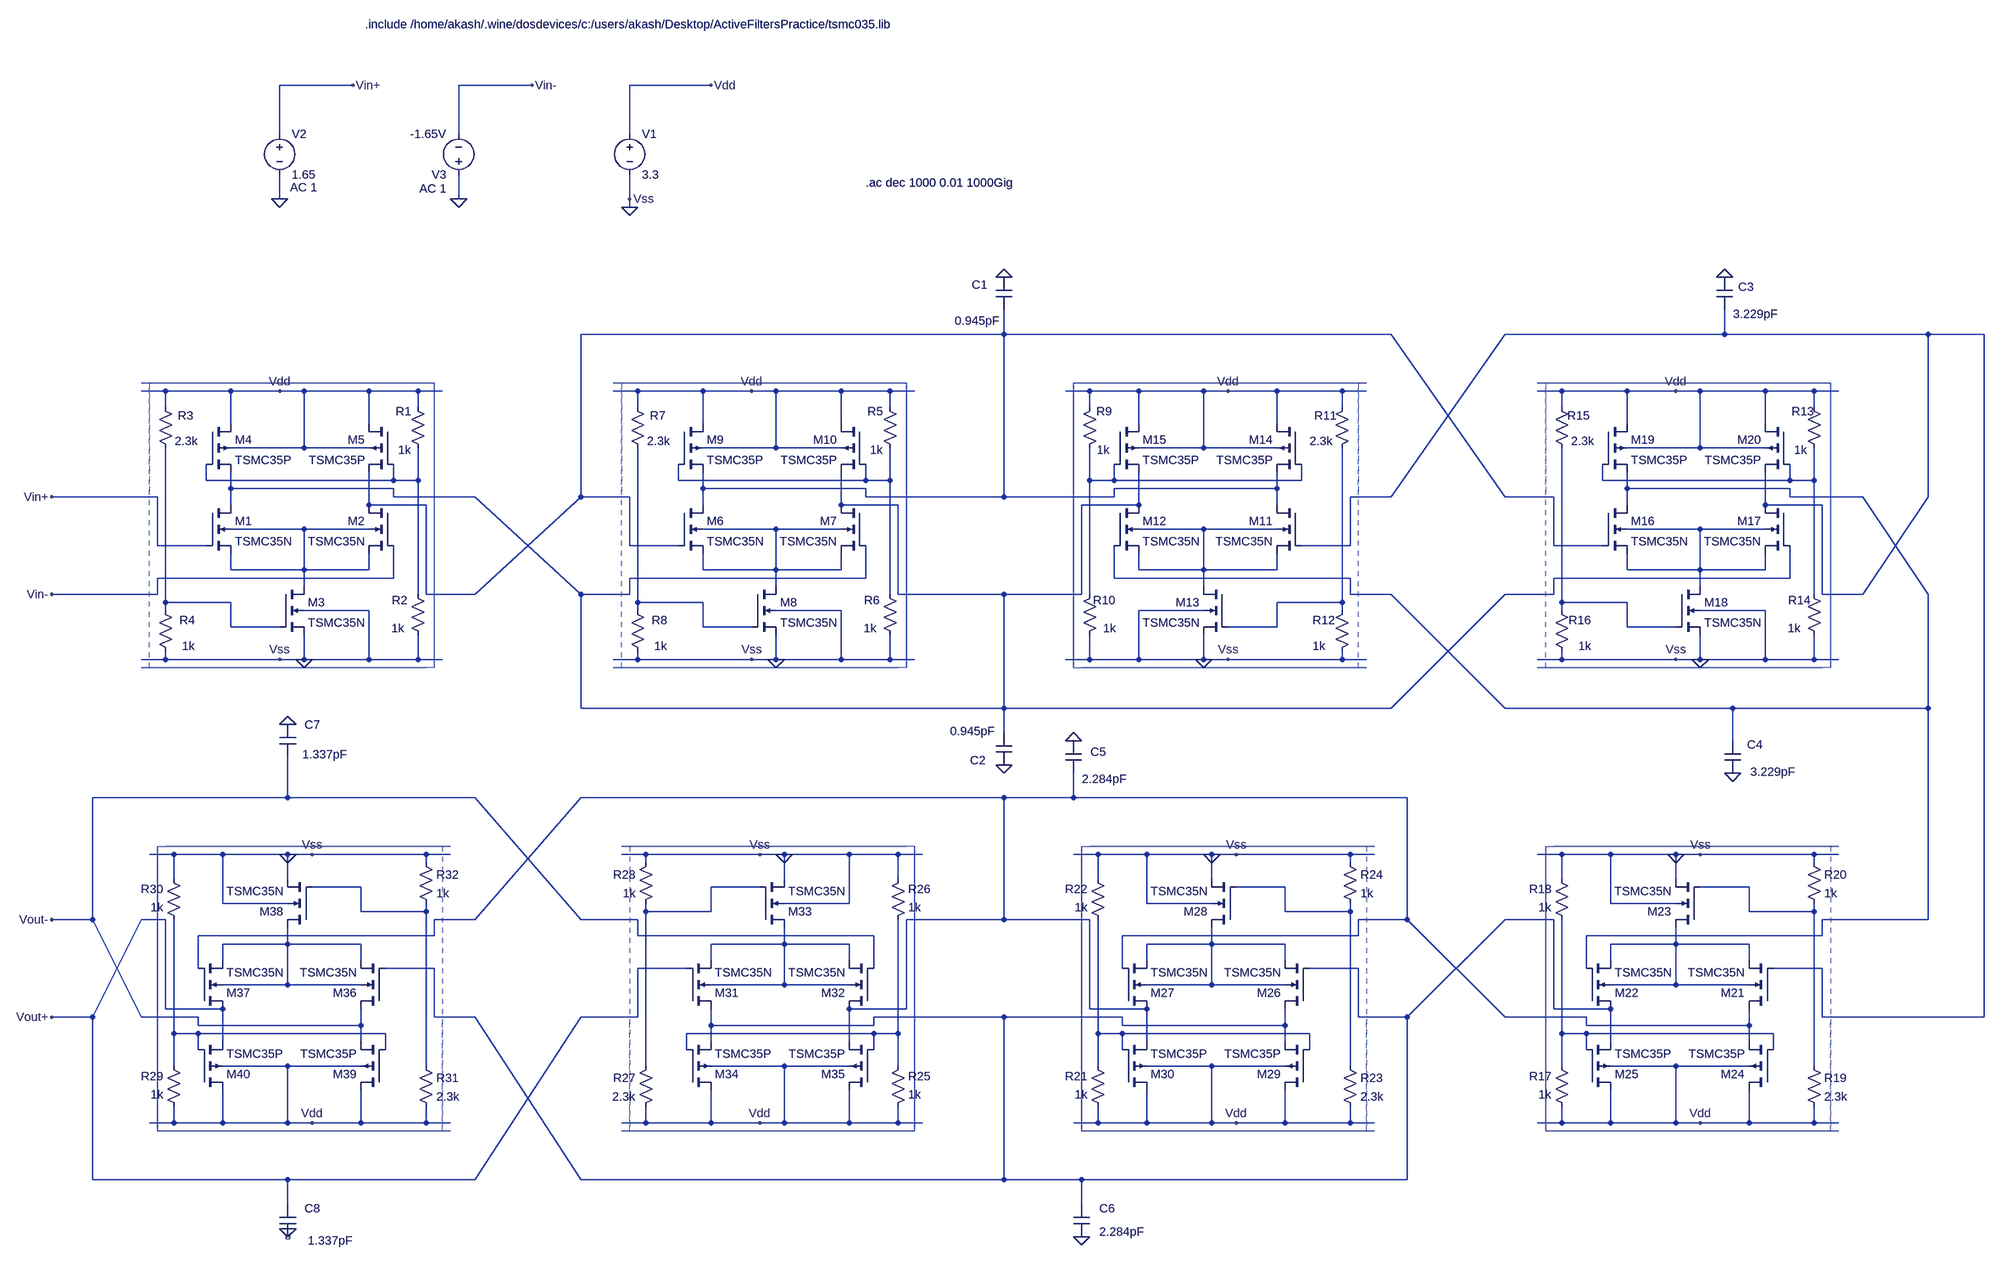
[diagram p0: schematic AF_Project_Transistor_Level_Realization.asc]
AF_Project_Transistor_Level_Realization.asc, the LTspice schematic file:
Version 4
SHEET 1 3188 1768
WIRE -144 -592 -288 -592
WIRE 208 -592 64 -592
WIRE 560 -592 400 -592
WIRE -288 -496 -288 -592
WIRE 64 -496 64 -592
WIRE 400 -496 400 -592
WIRE -288 -368 -288 -416
WIRE 64 -368 64 -416
WIRE 400 -368 400 -416
WIRE 400 -352 400 -368
WIRE 1136 -32 1136 -80
WIRE 1136 -32 304 -32
WIRE 2000 -32 1136 -32
WIRE 2656 -32 2656 -80
WIRE 2656 -32 2224 -32
WIRE 3056 -32 2656 -32
WIRE 3184 -32 3056 -32
WIRE -512 80 -560 80
WIRE -384 80 -512 80
WIRE -288 80 -384 80
WIRE -240 80 -288 80
WIRE -112 80 -240 80
WIRE -16 80 -112 80
WIRE 32 80 -16 80
WIRE 416 80 368 80
WIRE 544 80 416 80
WIRE 640 80 544 80
WIRE 688 80 640 80
WIRE 816 80 688 80
WIRE 912 80 816 80
WIRE 960 80 912 80
WIRE 1408 80 1360 80
WIRE 1504 80 1408 80
WIRE 1632 80 1504 80
WIRE 1680 80 1632 80
WIRE 1776 80 1680 80
WIRE 1904 80 1776 80
WIRE 1952 80 1904 80
WIRE 2336 80 2288 80
WIRE 2464 80 2336 80
WIRE 2560 80 2464 80
WIRE 2608 80 2560 80
WIRE 2736 80 2608 80
WIRE 2832 80 2736 80
WIRE 2880 80 2832 80
WIRE -512 112 -512 80
WIRE -16 112 -16 80
WIRE 416 112 416 80
WIRE 912 112 912 80
WIRE 1408 112 1408 80
WIRE 1904 112 1904 80
WIRE 2336 112 2336 80
WIRE 2832 112 2832 80
WIRE -384 144 -384 80
WIRE -112 144 -112 80
WIRE 544 144 544 80
WIRE 816 144 816 80
WIRE 1504 144 1504 80
WIRE 1776 144 1776 80
WIRE 2464 144 2464 80
WIRE 2736 144 2736 80
WIRE -240 192 -240 80
WIRE -240 192 -384 192
WIRE -112 192 -240 192
WIRE 688 192 688 80
WIRE 688 192 544 192
WIRE 816 192 688 192
WIRE 1632 192 1632 80
WIRE 1632 192 1504 192
WIRE 1776 192 1632 192
WIRE 2608 192 2608 80
WIRE 2608 192 2464 192
WIRE 2736 192 2608 192
WIRE -432 256 -432 224
WIRE -64 256 -64 224
WIRE -64 256 -432 256
WIRE -16 256 -16 192
WIRE -16 256 -64 256
WIRE 496 256 496 224
WIRE 864 256 864 224
WIRE 864 256 496 256
WIRE 912 256 912 192
WIRE 912 256 864 256
WIRE 1408 256 1408 192
WIRE 1456 256 1456 224
WIRE 1456 256 1408 256
WIRE 1824 256 1824 224
WIRE 1824 256 1456 256
WIRE 2416 256 2416 224
WIRE 2784 256 2784 224
WIRE 2784 256 2416 256
WIRE 2832 256 2832 192
WIRE 2832 256 2784 256
WIRE -384 272 -384 240
WIRE -64 272 -384 272
WIRE 544 272 544 240
WIRE 864 272 544 272
WIRE 1776 272 1776 240
WIRE 1776 272 1456 272
WIRE 2464 272 2464 240
WIRE 2784 272 2464 272
WIRE -528 288 -736 288
WIRE -64 288 -64 272
WIRE 96 288 -64 288
WIRE 304 288 304 -32
WIRE 400 288 304 288
WIRE 864 288 864 272
WIRE 1136 288 1136 -32
WIRE 1136 288 864 288
WIRE 1456 288 1456 272
WIRE 1456 288 1136 288
WIRE 2000 288 2224 -32
WIRE 2000 288 1920 288
WIRE 2224 288 2000 -32
WIRE 2320 288 2224 288
WIRE 2784 288 2784 272
WIRE 2928 288 2784 288
WIRE 3056 288 3056 -32
WIRE -384 304 -384 272
WIRE -112 304 -112 240
WIRE 0 304 -112 304
WIRE 544 304 544 272
WIRE 816 304 816 240
WIRE 928 304 816 304
WIRE 1504 304 1504 240
WIRE 1504 304 1392 304
WIRE 1776 304 1776 272
WIRE 2464 304 2464 272
WIRE 2736 304 2736 240
WIRE 2848 304 2736 304
WIRE -240 352 -384 352
WIRE -112 352 -240 352
WIRE 688 352 544 352
WIRE 816 352 688 352
WIRE 1632 352 1504 352
WIRE 1776 352 1632 352
WIRE 2608 352 2464 352
WIRE 2736 352 2608 352
WIRE -528 384 -528 288
WIRE -432 384 -528 384
WIRE 400 384 400 288
WIRE 496 384 400 384
WIRE 1920 384 1920 288
WIRE 1920 384 1824 384
WIRE 2320 384 2320 288
WIRE 2416 384 2320 384
WIRE -384 432 -384 400
WIRE -240 432 -240 352
WIRE -240 432 -384 432
WIRE -112 432 -112 400
WIRE -112 432 -240 432
WIRE 544 432 544 400
WIRE 688 432 688 352
WIRE 688 432 544 432
WIRE 816 432 816 400
WIRE 816 432 688 432
WIRE 1504 432 1504 400
WIRE 1632 432 1632 352
WIRE 1632 432 1504 432
WIRE 1776 432 1776 400
WIRE 1776 432 1632 432
WIRE 2464 432 2464 400
WIRE 2608 432 2608 352
WIRE 2608 432 2464 432
WIRE 2736 432 2736 400
WIRE 2736 432 2608 432
WIRE -64 448 -64 384
WIRE -64 448 -528 448
WIRE 864 448 864 384
WIRE 864 448 400 448
WIRE 1456 448 1456 384
WIRE 1920 448 1456 448
WIRE 2784 448 2784 384
WIRE 2784 448 2320 448
WIRE -240 464 -240 432
WIRE 688 464 688 432
WIRE 1632 464 1632 432
WIRE 2608 464 2608 432
WIRE -528 480 -528 448
WIRE -528 480 -736 480
WIRE -16 480 -16 256
WIRE 0 480 0 304
WIRE 96 480 304 288
WIRE 96 480 0 480
WIRE 304 480 96 288
WIRE 400 480 400 448
WIRE 400 480 304 480
WIRE 912 480 912 256
WIRE 928 480 928 304
WIRE 1136 480 928 480
WIRE 1392 480 1392 304
WIRE 1392 480 1136 480
WIRE 1408 480 1408 256
WIRE 1920 480 1920 448
WIRE 2000 480 1920 480
WIRE 2320 480 2320 448
WIRE 2320 480 2224 480
WIRE 2832 480 2832 256
WIRE 2848 480 2848 304
WIRE 2928 480 3056 288
WIRE 2928 480 2848 480
WIRE 3056 480 2928 288
WIRE -512 496 -512 192
WIRE -384 496 -512 496
WIRE 416 496 416 192
WIRE 544 496 416 496
WIRE 1904 496 1904 192
WIRE 1904 496 1776 496
WIRE 2336 496 2336 192
WIRE 2464 496 2336 496
WIRE -512 512 -512 496
WIRE -112 512 -240 512
WIRE 416 512 416 496
WIRE 816 512 688 512
WIRE 1632 512 1504 512
WIRE 1904 512 1904 496
WIRE 2336 512 2336 496
WIRE 2736 512 2608 512
WIRE -384 544 -384 496
WIRE -288 544 -384 544
WIRE 544 544 544 496
WIRE 640 544 544 544
WIRE 1776 544 1776 496
WIRE 1776 544 1680 544
WIRE 2464 544 2464 496
WIRE 2560 544 2464 544
WIRE -512 608 -512 592
WIRE -512 608 -560 608
WIRE -288 608 -512 608
WIRE -240 608 -240 560
WIRE -240 608 -288 608
WIRE -112 608 -112 512
WIRE -112 608 -240 608
WIRE -16 608 -16 560
WIRE -16 608 -112 608
WIRE 32 608 -16 608
WIRE 416 608 416 592
WIRE 416 608 368 608
WIRE 640 608 416 608
WIRE 688 608 688 560
WIRE 688 608 640 608
WIRE 816 608 816 512
WIRE 816 608 688 608
WIRE 912 608 912 560
WIRE 912 608 816 608
WIRE 960 608 912 608
WIRE 1408 608 1408 560
WIRE 1408 608 1360 608
WIRE 1504 608 1504 512
WIRE 1504 608 1408 608
WIRE 1632 608 1632 560
WIRE 1632 608 1504 608
WIRE 1680 608 1632 608
WIRE 1904 608 1904 592
WIRE 1904 608 1680 608
WIRE 1952 608 1904 608
WIRE 2336 608 2336 592
WIRE 2336 608 2288 608
WIRE 2560 608 2336 608
WIRE 2608 608 2608 560
WIRE 2608 608 2560 608
WIRE 2736 608 2736 512
WIRE 2736 608 2608 608
WIRE 2832 608 2832 560
WIRE 2832 608 2736 608
WIRE 2880 608 2832 608
WIRE 304 704 304 480
WIRE 1136 704 1136 480
WIRE 1136 704 304 704
WIRE 2000 704 2224 480
WIRE 2000 704 1136 704
WIRE 2224 704 2000 480
WIRE 2672 704 2224 704
WIRE 3056 704 3056 480
WIRE 3056 704 2672 704
WIRE 1136 752 1136 704
WIRE 2672 768 2672 704
WIRE -272 880 -272 800
WIRE -272 880 -656 880
WIRE 96 880 -272 880
WIRE 1136 880 304 880
WIRE 1376 880 1376 832
WIRE 1376 880 1136 880
WIRE 2032 880 1376 880
WIRE -496 992 -544 992
WIRE -400 992 -496 992
WIRE -272 992 -400 992
WIRE -224 992 -272 992
WIRE 0 992 -224 992
WIRE 48 992 0 992
WIRE 432 992 384 992
WIRE 656 992 432 992
WIRE 704 992 656 992
WIRE 832 992 704 992
WIRE 928 992 832 992
WIRE 976 992 928 992
WIRE 1424 992 1376 992
WIRE 1520 992 1424 992
WIRE 1648 992 1520 992
WIRE 1696 992 1648 992
WIRE 1920 992 1696 992
WIRE 1968 992 1920 992
WIRE 2336 992 2288 992
WIRE 2432 992 2336 992
WIRE 2560 992 2432 992
WIRE 2608 992 2560 992
WIRE 2832 992 2608 992
WIRE 2880 992 2832 992
WIRE 0 1008 0 992
WIRE 432 1008 432 992
WIRE 1920 1008 1920 992
WIRE 2832 1008 2832 992
WIRE -496 1040 -496 992
WIRE -272 1040 -272 992
WIRE 704 1040 704 992
WIRE 928 1040 928 992
WIRE 1424 1040 1424 992
WIRE 1648 1040 1648 992
WIRE 2336 1040 2336 992
WIRE 2560 1040 2560 992
WIRE -128 1056 -224 1056
WIRE 656 1056 560 1056
WIRE 1792 1056 1696 1056
WIRE 2704 1056 2608 1056
WIRE -400 1088 -400 992
WIRE -272 1088 -400 1088
WIRE 832 1088 832 992
WIRE 832 1088 704 1088
WIRE 1520 1088 1520 992
WIRE 1648 1088 1520 1088
WIRE 2432 1088 2432 992
WIRE 2560 1088 2432 1088
WIRE -128 1104 -128 1056
WIRE 0 1104 0 1088
WIRE 0 1104 -128 1104
WIRE 432 1104 432 1088
WIRE 560 1104 560 1056
WIRE 560 1104 432 1104
WIRE 1792 1104 1792 1056
WIRE 1920 1104 1920 1088
WIRE 1920 1104 1792 1104
WIRE 2704 1104 2704 1056
WIRE 2832 1104 2832 1088
WIRE 2832 1104 2704 1104
WIRE -656 1120 -656 880
WIRE -656 1120 -736 1120
WIRE -512 1120 -560 1120
WIRE 96 1120 304 880
WIRE 96 1120 16 1120
WIRE 304 1120 96 880
WIRE 416 1120 304 1120
WIRE 1136 1120 1136 880
WIRE 1136 1120 944 1120
WIRE 1408 1120 1136 1120
WIRE 2032 1120 2032 880
WIRE 2032 1120 1936 1120
WIRE 2320 1120 2224 1120
WIRE 3056 1120 3056 704
WIRE 3056 1120 2848 1120
WIRE 16 1152 16 1120
WIRE 16 1152 -448 1152
WIRE 416 1152 416 1120
WIRE 880 1152 416 1152
WIRE 1936 1152 1936 1120
WIRE 1936 1152 1472 1152
WIRE 2848 1152 2848 1120
WIRE 2848 1152 2384 1152
WIRE -272 1168 -272 1136
WIRE -272 1168 -400 1168
WIRE -128 1168 -272 1168
WIRE 704 1168 704 1136
WIRE 704 1168 560 1168
WIRE 832 1168 704 1168
WIRE 1648 1168 1648 1136
WIRE 1648 1168 1520 1168
WIRE 1792 1168 1648 1168
WIRE 2560 1168 2560 1136
WIRE 2560 1168 2432 1168
WIRE 2704 1168 2560 1168
WIRE -400 1200 -400 1168
WIRE -128 1200 -128 1168
WIRE 560 1200 560 1168
WIRE 832 1200 832 1168
WIRE 1520 1200 1520 1168
WIRE 1792 1200 1792 1168
WIRE 2432 1200 2432 1168
WIRE 2704 1200 2704 1168
WIRE -448 1216 -448 1152
WIRE 16 1216 -80 1216
WIRE 512 1216 416 1216
WIRE 880 1216 880 1152
WIRE 1472 1216 1472 1152
WIRE 1936 1216 1840 1216
WIRE 2384 1216 2384 1152
WIRE 2848 1216 2752 1216
WIRE -272 1248 -272 1168
WIRE -272 1248 -400 1248
WIRE -128 1248 -272 1248
WIRE 704 1248 704 1168
WIRE 704 1248 560 1248
WIRE 832 1248 704 1248
WIRE 1648 1248 1648 1168
WIRE 1648 1248 1520 1248
WIRE 1792 1248 1648 1248
WIRE 2560 1248 2560 1168
WIRE 2560 1248 2432 1248
WIRE 2704 1248 2560 1248
WIRE -512 1296 -512 1120
WIRE -400 1296 -512 1296
WIRE 944 1296 944 1120
WIRE 944 1296 832 1296
WIRE 1408 1296 1408 1120
WIRE 1520 1296 1408 1296
WIRE 2320 1296 2320 1120
WIRE 2432 1296 2320 1296
WIRE -656 1312 -560 1120
WIRE -656 1312 -736 1312
WIRE -560 1312 -656 1120
WIRE -448 1312 -560 1312
WIRE 16 1312 16 1216
WIRE 96 1312 16 1312
WIRE 416 1312 416 1216
WIRE 416 1312 304 1312
WIRE 1136 1312 880 1312
WIRE 1472 1312 1136 1312
WIRE 1936 1312 1936 1216
WIRE 2032 1312 2224 1120
WIRE 2032 1312 1936 1312
WIRE 2224 1312 2032 1120
WIRE 2384 1312 2224 1312
WIRE 2848 1312 2848 1216
WIRE 3184 1312 3184 -32
WIRE 3184 1312 2848 1312
WIRE -448 1328 -448 1312
WIRE -128 1328 -128 1296
WIRE -128 1328 -448 1328
WIRE 560 1328 560 1296
WIRE 880 1328 880 1312
WIRE 880 1328 560 1328
WIRE 1472 1328 1472 1312
WIRE 1792 1328 1792 1296
WIRE 1792 1328 1472 1328
WIRE 2384 1328 2384 1312
WIRE 2704 1328 2704 1296
WIRE 2704 1328 2384 1328
WIRE -496 1344 -496 1120
WIRE -448 1344 -496 1344
WIRE -80 1344 -448 1344
WIRE 880 1344 512 1344
WIRE 928 1344 928 1120
WIRE 928 1344 880 1344
WIRE 1424 1344 1424 1120
WIRE 1472 1344 1424 1344
WIRE 1840 1344 1472 1344
WIRE 2336 1344 2336 1120
WIRE 2384 1344 2336 1344
WIRE 2752 1344 2384 1344
WIRE -400 1360 -400 1296
WIRE -128 1360 -128 1328
WIRE 560 1360 560 1328
WIRE 832 1360 832 1296
WIRE 1520 1360 1520 1296
WIRE 1792 1360 1792 1328
WIRE 2432 1360 2432 1296
WIRE 2704 1360 2704 1328
WIRE -448 1376 -448 1344
WIRE -80 1376 -80 1344
WIRE 512 1376 512 1344
WIRE 880 1376 880 1344
WIRE 1472 1376 1472 1344
WIRE 1840 1376 1840 1344
WIRE 2384 1376 2384 1344
WIRE 2752 1376 2752 1344
WIRE -496 1408 -496 1344
WIRE -272 1408 -400 1408
WIRE -128 1408 -272 1408
WIRE 0 1408 0 1104
WIRE 432 1408 432 1104
WIRE 704 1408 560 1408
WIRE 832 1408 704 1408
WIRE 928 1408 928 1344
WIRE 1424 1408 1424 1344
WIRE 1648 1408 1520 1408
WIRE 1792 1408 1648 1408
WIRE 1920 1408 1920 1104
WIRE 2336 1408 2336 1344
WIRE 2560 1408 2432 1408
WIRE 2704 1408 2560 1408
WIRE 2832 1408 2832 1104
WIRE -496 1520 -496 1488
WIRE -496 1520 -544 1520
WIRE -400 1520 -400 1456
WIRE -400 1520 -496 1520
WIRE -272 1520 -272 1408
WIRE -272 1520 -400 1520
WIRE -224 1520 -272 1520
WIRE -128 1520 -128 1456
WIRE -128 1520 -224 1520
WIRE 0 1520 0 1488
WIRE 0 1520 -128 1520
WIRE 48 1520 0 1520
WIRE 432 1520 432 1488
WIRE 432 1520 384 1520
WIRE 560 1520 560 1456
WIRE 560 1520 432 1520
WIRE 656 1520 560 1520
WIRE 704 1520 704 1408
WIRE 704 1520 656 1520
WIRE 832 1520 832 1456
WIRE 832 1520 704 1520
WIRE 928 1520 928 1488
WIRE 928 1520 832 1520
WIRE 976 1520 928 1520
WIRE 1424 1520 1424 1488
WIRE 1424 1520 1376 1520
WIRE 1520 1520 1520 1456
WIRE 1520 1520 1424 1520
WIRE 1648 1520 1648 1408
WIRE 1648 1520 1520 1520
WIRE 1696 1520 1648 1520
WIRE 1792 1520 1792 1456
WIRE 1792 1520 1696 1520
WIRE 1920 1520 1920 1488
WIRE 1920 1520 1792 1520
WIRE 1968 1520 1920 1520
WIRE 2336 1520 2336 1488
WIRE 2336 1520 2288 1520
WIRE 2432 1520 2432 1456
WIRE 2432 1520 2336 1520
WIRE 2560 1520 2560 1408
WIRE 2560 1520 2432 1520
WIRE 2608 1520 2560 1520
WIRE 2704 1520 2704 1456
WIRE 2704 1520 2608 1520
WIRE 2832 1520 2832 1488
WIRE 2832 1520 2704 1520
WIRE 2880 1520 2832 1520
WIRE -656 1632 -656 1312
WIRE -272 1632 -656 1632
WIRE 96 1632 304 1312
WIRE 96 1632 -272 1632
WIRE 304 1632 96 1312
WIRE 1136 1632 1136 1312
WIRE 1136 1632 304 1632
WIRE 1392 1632 1136 1632
WIRE 2032 1632 2032 1312
WIRE 2032 1632 1392 1632
WIRE -272 1680 -272 1632
WIRE 1392 1680 1392 1632
FLAG 400 -352 0
FLAG 400 -368 Vss
FLAG 560 -592 Vdd
FLAG -288 80 Vdd
FLAG -288 608 Vss
FLAG -240 608 0
FLAG -288 -368 0
FLAG -144 -592 Vin+
FLAG 64 -368 0
FLAG 208 -592 Vin-
FLAG 640 80 Vdd
FLAG 640 608 Vss
FLAG 688 608 0
FLAG 1680 80 Vdd
FLAG 1680 608 Vss
FLAG 1632 608 0
FLAG 2560 80 Vdd
FLAG 2560 608 Vss
FLAG 2608 608 0
FLAG 2608 1520 Vdd
FLAG 2608 992 Vss
FLAG 2560 992 0
FLAG 1696 1520 Vdd
FLAG 1696 992 Vss
FLAG 1648 992 0
FLAG 656 1520 Vdd
FLAG 656 992 Vss
FLAG 704 992 0
FLAG -224 1520 Vdd
FLAG -224 992 Vss
FLAG -272 992 0
FLAG -736 288 Vin+
FLAG -736 480 Vin-
FLAG 1136 -144 0
FLAG 1136 816 0
FLAG 2672 832 0
FLAG 2656 -144 0
FLAG 1376 768 0
FLAG 1392 1744 0
FLAG -272 736 0
FLAG -272 1728 0
FLAG -736 1312 Vout+
FLAG -736 1120 Vout-
SYMBOL nmos4 -432 304 R0
SYMATTR InstName M1
SYMATTR Value TSMC35N
SYMATTR Value2 l=0.5u w=55u m=2
SYMBOL nmos4 -64 304 M0
SYMATTR InstName M2
SYMATTR Value TSMC35N
SYMATTR Value2 l=0.5u w=55u m=2
SYMBOL nmos4 -288 464 R0
SYMATTR InstName M3
SYMATTR Value TSMC35N
SYMATTR Value2 l=0.5u w=12.2093u m=2
SYMBOL pmos4 -432 144 R0
SYMATTR InstName M4
SYMATTR Value TSMC35P
SYMATTR Value2 l=0.5u w=2u m=2
SYMBOL pmos4 -64 144 M0
SYMATTR InstName M5
SYMATTR Value TSMC35P
SYMATTR Value2 l=0.5u w=2u m=2
SYMBOL res -32 96 R0
WINDOW 0 -28 24 Left 2
WINDOW 3 -23 100 Left 2
SYMATTR InstName R1
SYMATTR Value 1k
SYMBOL res -32 464 R0
WINDOW 0 -35 28 Left 2
WINDOW 3 -36 83 Left 2
SYMATTR InstName R2
SYMATTR Value 1k
SYMBOL res -496 208 R180
WINDOW 0 -39 80 Left 2
WINDOW 3 -48 30 Left 2
SYMATTR InstName R3
SYMATTR Value 2.3k
SYMBOL res -496 608 R180
WINDOW 0 -42 77 Left 2
WINDOW 3 -42 26 Left 2
SYMATTR InstName R4
SYMATTR Value 1k
SYMBOL voltage 400 -512 R0
WINDOW 123 0 0 Left 0
WINDOW 39 0 0 Left 0
SYMATTR InstName V1
SYMATTR Value 3.3
SYMBOL voltage -288 -512 R0
WINDOW 123 21 121 Left 2
WINDOW 39 0 0 Left 0
SYMATTR InstName V2
SYMATTR Value 1.65
SYMATTR Value2 AC 1
SYMBOL voltage 64 -400 R180
WINDOW 123 24 -12 Left 2
WINDOW 39 0 0 Left 0
SYMATTR InstName V3
SYMATTR Value -1.65V
SYMATTR Value2 AC 1
SYMBOL nmos4 496 304 R0
SYMATTR InstName M6
SYMATTR Value TSMC35N
SYMATTR Value2 l=0.5u w=55u m=2
SYMBOL nmos4 864 304 M0
SYMATTR InstName M7
SYMATTR Value TSMC35N
SYMATTR Value2 l=0.5u w=55u m=2
SYMBOL nmos4 640 464 R0
SYMATTR InstName M8
SYMATTR Value TSMC35N
SYMATTR Value2 l=0.5u w=12.2093u m=2
SYMBOL pmos4 496 144 R0
SYMATTR InstName M9
SYMATTR Value TSMC35P
SYMATTR Value2 l=0.5u w=2u m=2
SYMBOL pmos4 864 144 M0
SYMATTR InstName M10
SYMATTR Value TSMC35P
SYMATTR Value2 l=0.5u w=2u m=2
SYMBOL res 896 96 R0
WINDOW 0 -28 24 Left 2
WINDOW 3 -23 100 Left 2
SYMATTR InstName R5
SYMATTR Value 1k
SYMBOL res 896 464 R0
WINDOW 0 -35 28 Left 2
WINDOW 3 -36 83 Left 2
SYMATTR InstName R6
SYMATTR Value 1k
SYMBOL res 432 208 R180
WINDOW 0 -39 80 Left 2
WINDOW 3 -48 30 Left 2
SYMATTR InstName R7
SYMATTR Value 2.3k
SYMBOL res 432 608 R180
WINDOW 0 -42 77 Left 2
WINDOW 3 -42 26 Left 2
SYMATTR InstName R8
SYMATTR Value 1k
SYMBOL nmos4 1824 304 M0
SYMATTR InstName M11
SYMATTR Value TSMC35N
SYMATTR Value2 l=0.5u w=55u m=2
SYMBOL nmos4 1456 304 R0
SYMATTR InstName M12
SYMATTR Value TSMC35N
SYMATTR Value2 l=0.5u w=55u m=2
SYMBOL nmos4 1680 464 M0
SYMATTR InstName M13
SYMATTR Value TSMC35N
SYMATTR Value2 l=0.5u w=12.2093u m=2
SYMBOL pmos4 1824 144 M0
SYMATTR InstName M14
SYMATTR Value TSMC35P
SYMATTR Value2 l=0.5u w=2u m=2
SYMBOL pmos4 1456 144 R0
SYMATTR InstName M15
SYMATTR Value TSMC35P
SYMATTR Value2 l=0.5u w=2u m=2
SYMBOL res 1424 96 M0
WINDOW 0 -28 24 Left 2
WINDOW 3 -23 100 Left 2
SYMATTR InstName R9
SYMATTR Value 1k
SYMBOL res 1424 464 M0
WINDOW 0 -35 28 Left 2
WINDOW 3 -36 83 Left 2
SYMATTR InstName R10
SYMATTR Value 1k
SYMBOL res 1888 208 M180
WINDOW 0 -39 80 Left 2
WINDOW 3 -48 30 Left 2
SYMATTR InstName R11
SYMATTR Value 2.3k
SYMBOL res 1888 608 M180
WINDOW 0 -42 77 Left 2
WINDOW 3 -42 26 Left 2
SYMATTR InstName R12
SYMATTR Value 1k
SYMBOL nmos4 2416 304 R0
SYMATTR InstName M16
SYMATTR Value TSMC35N
SYMATTR Value2 l=0.5u w=55u m=2
SYMBOL nmos4 2784 304 M0
SYMATTR InstName M17
SYMATTR Value TSMC35N
SYMATTR Value2 l=0.5u w=55u m=2
SYMBOL nmos4 2560 464 R0
SYMATTR InstName M18
SYMATTR Value TSMC35N
SYMATTR Value2 l=0.5u w=12.2093u m=2
SYMBOL pmos4 2416 144 R0
SYMATTR InstName M19
SYMATTR Value TSMC35P
SYMATTR Value2 l=0.5u w=2u m=2
SYMBOL pmos4 2784 144 M0
SYMATTR InstName M20
SYMATTR Value TSMC35P
SYMATTR Value2 l=0.5u w=2u m=2
SYMBOL res 2816 96 R0
WINDOW 0 -28 24 Left 2
WINDOW 3 -23 100 Left 2
SYMATTR InstName R13
SYMATTR Value 1k
SYMBOL res 2816 464 R0
WINDOW 0 -35 28 Left 2
WINDOW 3 -36 83 Left 2
SYMATTR InstName R14
SYMATTR Value 1k
SYMBOL res 2352 208 R180
WINDOW 0 -39 80 Left 2
WINDOW 3 -48 30 Left 2
SYMATTR InstName R15
SYMATTR Value 2.3k
SYMBOL res 2352 608 R180
WINDOW 0 -42 77 Left 2
WINDOW 3 -42 26 Left 2
SYMATTR InstName R16
SYMATTR Value 1k
SYMBOL nmos4 2752 1296 R180
SYMATTR InstName M21
SYMATTR Value TSMC35N
SYMATTR Value2 l=0.5u w=55u m=2
SYMBOL nmos4 2384 1296 M180
SYMATTR InstName M22
SYMATTR Value TSMC35N
SYMATTR Value2 l=0.5u w=55u m=2
SYMBOL nmos4 2608 1136 R180
SYMATTR InstName M23
SYMATTR Value TSMC35N
SYMATTR Value2 l=0.5u w=12.2093u m=2
SYMBOL pmos4 2752 1456 R180
SYMATTR InstName M24
SYMATTR Value TSMC35P
SYMATTR Value2 l=0.5u w=2u m=2
SYMBOL pmos4 2384 1456 M180
SYMATTR InstName M25
SYMATTR Value TSMC35P
SYMATTR Value2 l=0.5u w=2u m=2
SYMBOL res 2352 1504 R180
WINDOW 0 36 76 Left 2
WINDOW 3 36 40 Left 2
SYMATTR InstName R17
SYMATTR Value 1k
SYMBOL res 2352 1136 R180
WINDOW 0 36 76 Left 2
WINDOW 3 36 40 Left 2
SYMATTR InstName R18
SYMATTR Value 1k
SYMBOL res 2816 1392 R0
SYMATTR InstName R19
SYMATTR Value 2.3k
SYMBOL res 2816 992 R0
SYMATTR InstName R20
SYMATTR Value 1k
SYMBOL nmos4 1840 1296 R180
SYMATTR InstName M26
SYMATTR Value TSMC35N
SYMATTR Value2 l=0.5u w=55u m=2
SYMBOL nmos4 1472 1296 M180
SYMATTR InstName M27
SYMATTR Value TSMC35N
SYMATTR Value2 l=0.5u w=55u m=2
SYMBOL nmos4 1696 1136 R180
SYMATTR InstName M28
SYMATTR Value TSMC35N
SYMATTR Value2 l=0.5u w=12.2093u m=2
SYMBOL pmos4 1840 1456 R180
SYMATTR InstName M29
SYMATTR Value TSMC35P
SYMATTR Value2 l=0.5u w=2u m=2
SYMBOL pmos4 1472 1456 M180
SYMATTR InstName M30
SYMATTR Value TSMC35P
SYMATTR Value2 l=0.5u w=2u m=2
SYMBOL res 1440 1504 R180
WINDOW 0 36 76 Left 2
WINDOW 3 36 40 Left 2
SYMATTR InstName R21
SYMATTR Value 1k
SYMBOL res 1440 1136 R180
WINDOW 0 36 76 Left 2
WINDOW 3 36 40 Left 2
SYMATTR InstName R22
SYMATTR Value 1k
SYMBOL res 1904 1392 R0
SYMATTR InstName R23
SYMATTR Value 2.3k
SYMBOL res 1904 992 R0
SYMATTR InstName R24
SYMATTR Value 1k
SYMBOL nmos4 512 1296 M180
SYMATTR InstName M31
SYMATTR Value TSMC35N
SYMATTR Value2 l=0.5u w=55u m=2
SYMBOL nmos4 880 1296 R180
SYMATTR InstName M32
SYMATTR Value TSMC35N
SYMATTR Value2 l=0.5u w=55u m=2
SYMBOL nmos4 656 1136 M180
SYMATTR InstName M33
SYMATTR Value TSMC35N
SYMATTR Value2 l=0.5u w=12.2093u m=2
SYMBOL pmos4 512 1456 M180
SYMATTR InstName M34
SYMATTR Value TSMC35P
SYMATTR Value2 l=0.5u w=2u m=2
SYMBOL pmos4 880 1456 R180
SYMATTR InstName M35
SYMATTR Value TSMC35P
SYMATTR Value2 l=0.5u w=2u m=2
SYMBOL res 912 1504 M180
WINDOW 0 36 76 Left 2
WINDOW 3 36 40 Left 2
SYMATTR InstName R25
SYMATTR Value 1k
SYMBOL res 912 1136 M180
WINDOW 0 36 76 Left 2
WINDOW 3 36 40 Left 2
SYMATTR InstName R26
SYMATTR Value 1k
SYMBOL res 448 1392 M0
SYMATTR InstName R27
SYMATTR Value 2.3k
SYMBOL res 448 992 M0
SYMATTR InstName R28
SYMATTR Value 1k
SYMBOL nmos4 -80 1296 R180
SYMATTR InstName M36
SYMATTR Value TSMC35N
SYMATTR Value2 l=0.5u w=55u m=2
SYMBOL nmos4 -448 1296 M180
SYMATTR InstName M37
SYMATTR Value TSMC35N
SYMATTR Value2 l=0.5u w=55u m=2
SYMBOL nmos4 -224 1136 R180
SYMATTR InstName M38
SYMATTR Value TSMC35N
SYMATTR Value2 l=0.5u w=12.2093u m=2
SYMBOL pmos4 -80 1456 R180
SYMATTR InstName M39
SYMATTR Value TSMC35P
SYMATTR Value2 l=0.5u w=2u m=2
SYMBOL pmos4 -448 1456 M180
SYMATTR InstName M40
SYMATTR Value TSMC35P
SYMATTR Value2 l=0.5u w=2u m=2
SYMBOL res -480 1504 R180
WINDOW 0 36 76 Left 2
WINDOW 3 36 40 Left 2
SYMATTR InstName R29
SYMATTR Value 1k
SYMBOL res -480 1136 R180
WINDOW 0 36 76 Left 2
WINDOW 3 36 40 Left 2
SYMATTR InstName R30
SYMATTR Value 1k
SYMBOL res -16 1392 R0
SYMATTR InstName R31
SYMATTR Value 2.3k
SYMBOL res -16 992 R0
SYMATTR InstName R32
SYMATTR Value 1k
SYMBOL cap 1120 -144 R0
WINDOW 0 -47 15 Left 2
WINDOW 3 -81 86 Left 2
SYMATTR InstName C1
SYMATTR Value 0.945pF
SYMBOL cap 1120 752 R0
WINDOW 0 -51 55 Left 2
WINDOW 3 -90 -3 Left 2
SYMATTR InstName C2
SYMATTR Value 0.945pF
SYMBOL cap 2640 -144 R0
WINDOW 0 43 19 Left 2
WINDOW 3 33 72 Left 2
SYMATTR InstName C3
SYMATTR Value 3.229pF
SYMBOL cap 2656 768 R0
WINDOW 0 44 8 Left 2
WINDOW 3 51 61 Left 2
SYMATTR InstName C4
SYMATTR Value 3.229pF
SYMBOL cap 1360 768 R0
WINDOW 0 49 22 Left 2
WINDOW 3 33 75 Left 2
SYMATTR InstName C5
SYMATTR Value 2.284pF
SYMBOL cap 1376 1680 R0
WINDOW 0 51 8 Left 2
WINDOW 3 51 54 Left 2
SYMATTR InstName C6
SYMATTR Value 2.284pF
SYMBOL cap -288 736 R0
WINDOW 0 49 1 Left 2
WINDOW 3 45 59 Left 2
SYMATTR InstName C7
SYMATTR Value 1.337pF
SYMBOL cap -288 1680 R0
WINDOW 0 49 8 Left 2
WINDOW 3 56 72 Left 2
SYMATTR InstName C8
SYMATTR Value 1.337pF
TEXT -120 -712 Left 2 !.include /home/akash/.wine/dosdevices/c:/users/akash/Desktop/ActiveFiltersPractice/tsmc035.lib
TEXT 864 -400 Left 2 !.ac dec 1000 0.01 1000Gig
LINE Normal 0 624 -560 624
LINE Normal 16 624 0 624 2
LINE Normal 16 64 16 624
LINE Normal -560 64 16 64
LINE Normal -544 64 -544 288 2
LINE Normal -544 624 -544 64 2
LINE Normal -544 624 -544 624 2
LINE Normal 928 624 368 624
LINE Normal 944 624 928 624 2
LINE Normal 944 64 944 624
LINE Normal 368 64 944 64
LINE Normal 384 64 384 288 2
LINE Normal 384 624 384 64 2
LINE Normal 384 624 384 624 2
LINE Normal 1392 624 1952 624
LINE Normal 1376 624 1392 624 2
LINE Normal 1376 64 1376 624
LINE Normal 1952 64 1376 64
LINE Normal 1936 64 1936 288 2
LINE Normal 1936 624 1936 64 2
LINE Normal 1936 624 1936 624 2
LINE Normal 2848 624 2288 624
LINE Normal 2864 624 2848 624 2
LINE Normal 2864 64 2864 624
LINE Normal 2288 64 2864 64
LINE Normal 2304 64 2304 288 2
LINE Normal 2304 624 2304 64 2
LINE Normal 2304 624 2304 624 2
LINE Normal 2320 976 2880 976
LINE Normal 2304 976 2320 976 2
LINE Normal 2304 1536 2304 976
LINE Normal 2880 1536 2304 1536
LINE Normal 2864 1536 2864 1312 2
LINE Normal 2864 976 2864 1536 2
LINE Normal 2864 976 2864 976 2
LINE Normal 1408 976 1968 976
LINE Normal 1392 976 1408 976 2
LINE Normal 1392 1536 1392 976
LINE Normal 1968 1536 1392 1536
LINE Normal 1952 1536 1952 1312 2
LINE Normal 1952 976 1952 1536 2
LINE Normal 1952 976 1952 976 2
LINE Normal 944 976 384 976
LINE Normal 960 976 944 976 2
LINE Normal 960 1536 960 976
LINE Normal 384 1536 960 1536
LINE Normal 400 1536 400 1312 2
LINE Normal 400 976 400 1536 2
LINE Normal 400 976 400 976 2
LINE Normal -512 976 48 976
LINE Normal -528 976 -512 976 2
LINE Normal -528 1536 -528 976
LINE Normal 48 1536 -528 1536
LINE Normal 32 1536 32 1312 2
LINE Normal 32 976 32 1536 2
LINE Normal 32 976 32 976 2

The netlist it stands for:
* AF_Project_Transistor_Level_Realization.asc
M1 N007 Vin+ N009 N009 TSMC35N l=0.5u w=55u m=2
M2 N001 Vin- N009 N009 TSMC35N l=0.5u w=55u m=2
M3 N009 N013 0 0 TSMC35N l=0.5u w=12.2093u m=2
M4 Vdd N003 N007 Vdd TSMC35P l=0.5u w=2u m=2
M5 Vdd N003 N001 Vdd TSMC35P l=0.5u w=2u m=2
R1 Vdd N003 1k
R2 N003 0 1k
R3 N013 Vdd 2.3k
R4 0 N013 1k
V1 Vdd 0 3.3
V2 Vin+ 0 1.65 AC 1
V3 0 Vin- -1.65V AC 1
M6 N001 N001 N010 N010 TSMC35N l=0.5u w=55u m=2
M7 N007 N007 N010 N010 TSMC35N l=0.5u w=55u m=2
M8 N010 N014 0 0 TSMC35N l=0.5u w=12.2093u m=2
M9 Vdd N004 N001 Vdd TSMC35P l=0.5u w=2u m=2
M10 Vdd N004 N007 Vdd TSMC35P l=0.5u w=2u m=2
R5 Vdd N004 1k
R6 N004 0 1k
R7 N014 Vdd 2.3k
R8 0 N014 1k
M11 N001 N002 N011 N011 TSMC35N l=0.5u w=55u m=2
M12 N007 N008 N011 N011 TSMC35N l=0.5u w=55u m=2
M13 N011 N015 0 0 TSMC35N l=0.5u w=12.2093u m=2
M14 Vdd N005 N001 Vdd TSMC35P l=0.5u w=2u m=2
M15 Vdd N005 N007 Vdd TSMC35P l=0.5u w=2u m=2
R9 Vdd N005 1k
R10 N005 0 1k
R11 N015 Vdd 2.3k
R12 0 N015 1k
M16 N008 N001 N012 N012 TSMC35N l=0.5u w=55u m=2
M17 N002 N007 N012 N012 TSMC35N l=0.5u w=55u m=2
M18 N012 N016 0 0 TSMC35N l=0.5u w=12.2093u m=2
M19 Vdd N006 N008 Vdd TSMC35P l=0.5u w=2u m=2
M20 Vdd N006 N002 Vdd TSMC35P l=0.5u w=2u m=2
R13 Vdd N006 1k
R14 N006 0 1k
R15 N016 Vdd 2.3k
R16 0 N016 1k
M21 N017 N002 N026 N026 TSMC35N l=0.5u w=55u m=2
M22 N022 N008 N026 N026 TSMC35N l=0.5u w=55u m=2
M23 N026 N021 0 0 TSMC35N l=0.5u w=12.2093u m=2
M24 Vdd N030 N017 Vdd TSMC35P l=0.5u w=2u m=2
M25 Vdd N030 N022 Vdd TSMC35P l=0.5u w=2u m=2
R17 Vdd N030 1k
R18 N030 0 1k
R19 N021 Vdd 2.3k
R20 0 N021 1k
M26 N022 N022 N025 N025 TSMC35N l=0.5u w=55u m=2
M27 N017 N017 N025 N025 TSMC35N l=0.5u w=55u m=2
M28 N025 N020 0 0 TSMC35N l=0.5u w=12.2093u m=2
M29 Vdd N029 N022 Vdd TSMC35P l=0.5u w=2u m=2
M30 Vdd N029 N017 Vdd TSMC35P l=0.5u w=2u m=2
R21 Vdd N029 1k
R22 N029 0 1k
R23 N020 Vdd 2.3k
R24 0 N020 1k
M31 N022 Vout+ N024 N024 TSMC35N l=0.5u w=55u m=2
M32 N017 Vout- N024 N024 TSMC35N l=0.5u w=55u m=2
M33 N024 N019 0 0 TSMC35N l=0.5u w=12.2093u m=2
M34 Vdd N028 N022 Vdd TSMC35P l=0.5u w=2u m=2
M35 Vdd N028 N017 Vdd TSMC35P l=0.5u w=2u m=2
R25 Vdd N028 1k
R26 N028 0 1k
R27 N019 Vdd 2.3k
R28 0 N019 1k
M36 Vout- N022 N023 N023 TSMC35N l=0.5u w=55u m=2
M37 Vout+ N017 N023 N023 TSMC35N l=0.5u w=55u m=2
M38 N023 N018 0 0 TSMC35N l=0.5u w=12.2093u m=2
M39 Vdd N027 Vout- Vdd TSMC35P l=0.5u w=2u m=2
M40 Vdd N027 Vout+ Vdd TSMC35P l=0.5u w=2u m=2
R29 Vdd N027 1k
R30 N027 0 1k
R31 N018 Vdd 2.3k
R32 0 N018 1k
C1 0 N001 0.945pF
C2 N007 0 0.945pF
C3 0 N002 3.229pF
C4 N008 0 3.229pF
C5 0 N017 2.284pF
C6 N022 0 2.284pF
C7 0 Vout- 1.337pF
C8 Vout+ NC_01 1.337pF
.model NMOS NMOS
.model PMOS PMOS
.lib standard.mos
.include /home/akash/.wine/dosdevices/c:/users/akash/Desktop/ActiveFiltersPractice/tsmc035.lib
.ac dec 1000 0.01 1000Gig
.backanno
.end